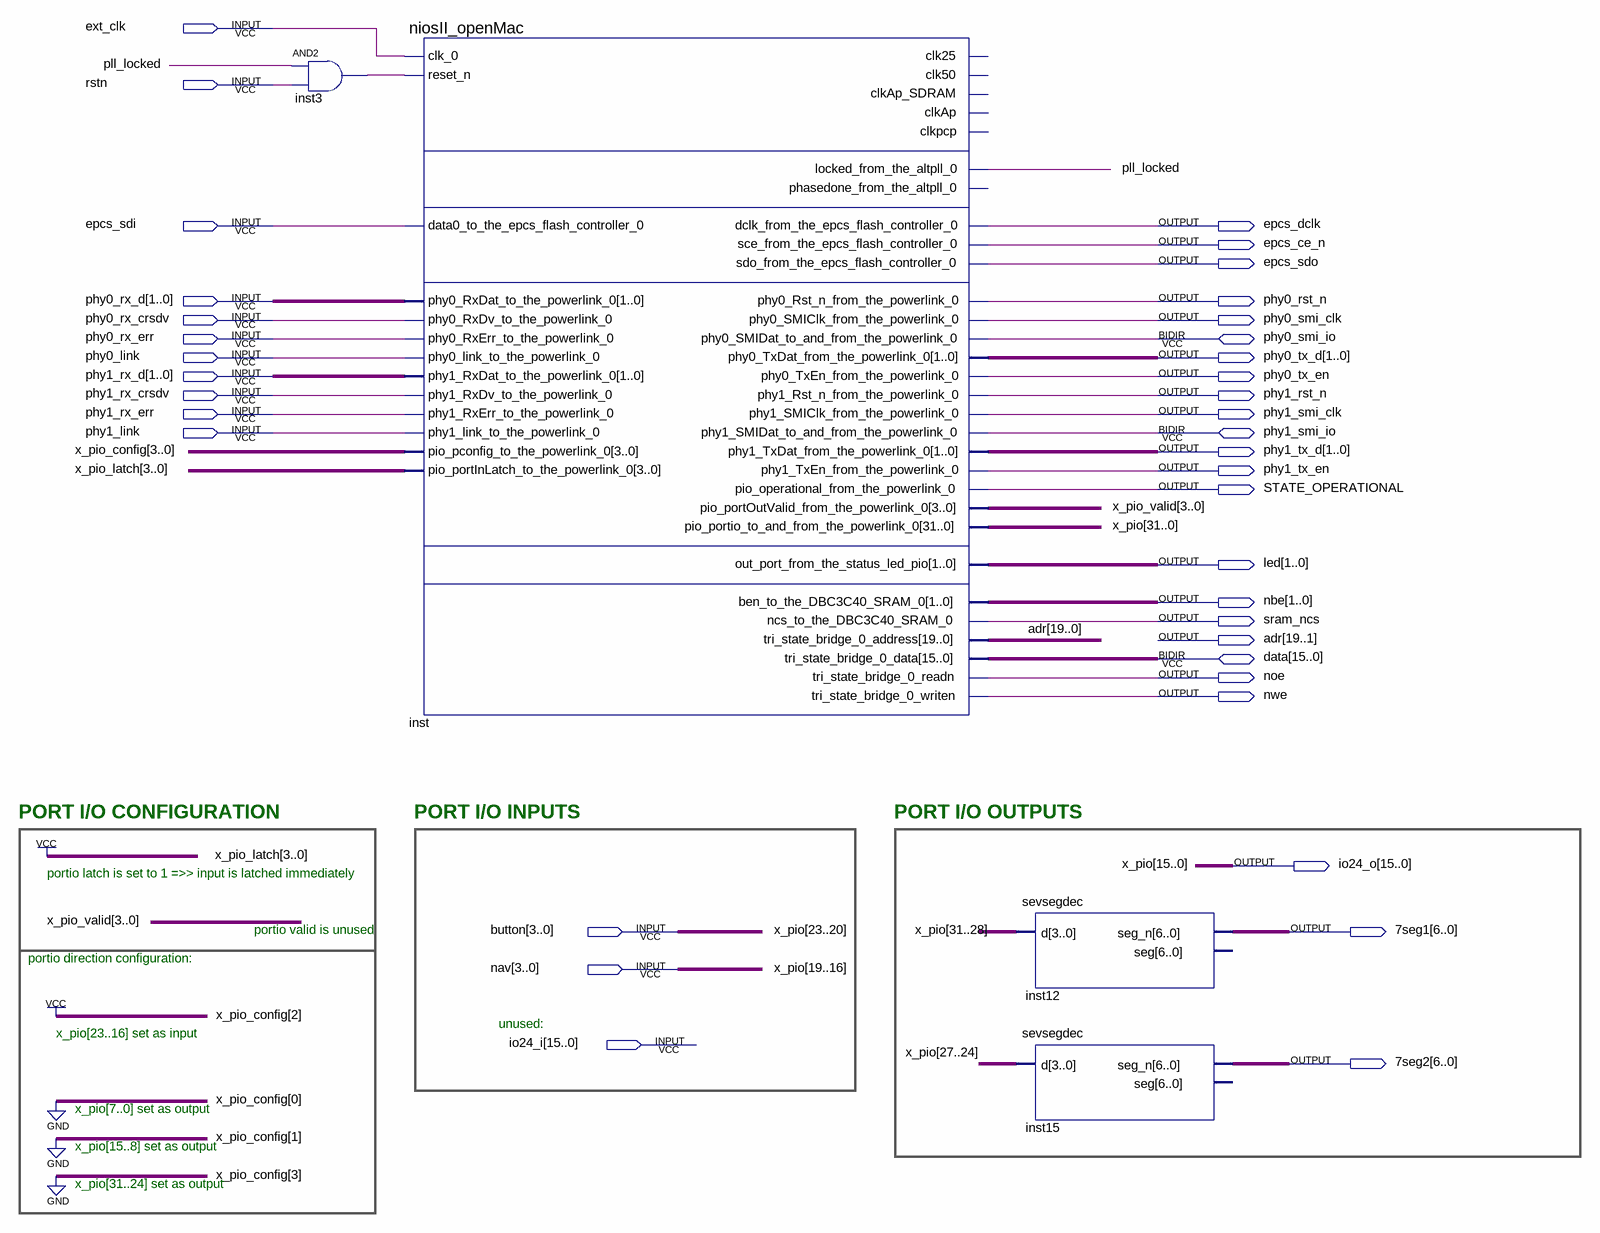
[diagram p0: schematic sheet]
// Quartus schematic nios_pll.bdf as structural Verilog: 4 symbols, 38 pins
module nios_pll (
  input  ext_clk,
  input  rstn,
  input  epcs_sdi,
  input  [1:0] phy0_rx_d,
  input  phy0_rx_crsdv,
  input  phy0_rx_err,
  input  phy0_link,
  input  [1:0] phy1_rx_d,
  input  phy1_rx_crsdv,
  input  phy1_rx_err,
  input  phy1_link,
  input  [3:0] button,
  input  [3:0] nav,
  input  [15:0] io24_i,
  inout  phy0_smi_io,
  inout  phy1_smi_io,
  inout  [15:0] data,
  output epcs_dclk,
  output epcs_ce_n,
  output epcs_sdo,
  output phy0_rst_n,
  output phy0_smi_clk,
  output [1:0] phy0_tx_d,
  output phy0_tx_en,
  output phy1_rst_n,
  output phy1_smi_clk,
  output [1:0] phy1_tx_d,
  output phy1_tx_en,
  output STATE_OPERATIONAL,
  output [1:0] led,
  output [1:0] nbe,
  output sram_ncs,
  output [19:0] adr,
  output noe,
  output nwe,
  output [15:0] io24_o,
  output [6:0] \7seg1 ,
  output [6:0] \7seg2 
);

  wire inst3_out, pll_locked;
  wire [3:0] x_pio_valid;
  wire [31:24] x_pio;

  and inst3 (inst3_out, pll_locked, rstn);
  niosII_openMac inst (
    .clk_0(ext_clk), .reset_n(inst3_out), .data0_to_the_epcs_flash_controller_0(epcs_sdi),
    .phy0_RxDat_to_the_powerlink_0(phy0_rx_d), .phy0_RxDv_to_the_powerlink_0(phy0_rx_crsdv),
    .phy0_RxErr_to_the_powerlink_0(phy0_rx_err), .phy0_link_to_the_powerlink_0(phy0_link),
    .phy1_RxDat_to_the_powerlink_0(phy1_rx_d), .phy1_RxDv_to_the_powerlink_0(phy1_rx_crsdv),
    .phy1_RxErr_to_the_powerlink_0(phy1_rx_err), .phy1_link_to_the_powerlink_0(phy1_link),
    .pio_pconfig_to_the_powerlink_0(4'b0100), .pio_portInLatch_to_the_powerlink_0(4'b1111),
    .locked_from_the_altpll_0(pll_locked), .dclk_from_the_epcs_flash_controller_0(epcs_dclk),
    .sce_from_the_epcs_flash_controller_0(epcs_ce_n), .sdo_from_the_epcs_flash_controller_0(epcs_sdo),
    .phy0_Rst_n_from_the_powerlink_0(phy0_rst_n), .phy0_SMIClk_from_the_powerlink_0(phy0_smi_clk),
    .phy0_TxDat_from_the_powerlink_0(phy0_tx_d), .phy0_TxEn_from_the_powerlink_0(phy0_tx_en),
    .phy1_Rst_n_from_the_powerlink_0(phy1_rst_n), .phy1_SMIClk_from_the_powerlink_0(phy1_smi_clk),
    .phy1_TxDat_from_the_powerlink_0(phy1_tx_d), .phy1_TxEn_from_the_powerlink_0(phy1_tx_en),
    .pio_operational_from_the_powerlink_0(STATE_OPERATIONAL),
    .pio_portOutValid_from_the_powerlink_0(x_pio_valid), .out_port_from_the_status_led_pio(led),
    .ben_to_the_DBC3C40_SRAM_0(nbe), .ncs_to_the_DBC3C40_SRAM_0(sram_ncs), .tri_state_bridge_0_address(adr),
    .tri_state_bridge_0_readn(noe), .tri_state_bridge_0_writen(nwe),
    .phy0_SMIDat_to_and_from_the_powerlink_0(phy0_smi_io),
    .phy1_SMIDat_to_and_from_the_powerlink_0(phy1_smi_io),
    .pio_portio_to_and_from_the_powerlink_0({x_pio, button, nav, io24_o}), .tri_state_bridge_0_data(data));  // open: clk25, clk50, clkAp_SDRAM, clkAp, clkpcp, phasedone_from_the_altpll_0
  sevsegdec inst12 (.d(x_pio[31:28]), .seg_n(\7seg1 ));  // open: seg
  sevsegdec inst15 (.d(x_pio[27:24]), .seg_n(\7seg2 ));  // open: seg

  // Other names for the same wires on the sheet: x_pio[23:0] = {button, nav, io24_o}

  // Notes on the sheet:
  //   PORT I/O CONFIGURATION
  //   PORT I/O INPUTS
  //   PORT I/O OUTPUTS
  //   portio latch is set to 1 =>> input is latched immediately
  //   portio valid is unused
  //   portio direction configuration:
  //   unused:
  //   x_pio[23..16] set as input
  //   x_pio[7..0] set as output
  //   x_pio[15..8] set as output
  //   x_pio[31..24] set as output
endmodule
